# EAGLE board sha2017_rev1_0_1 (EAGLE 6.6.0)
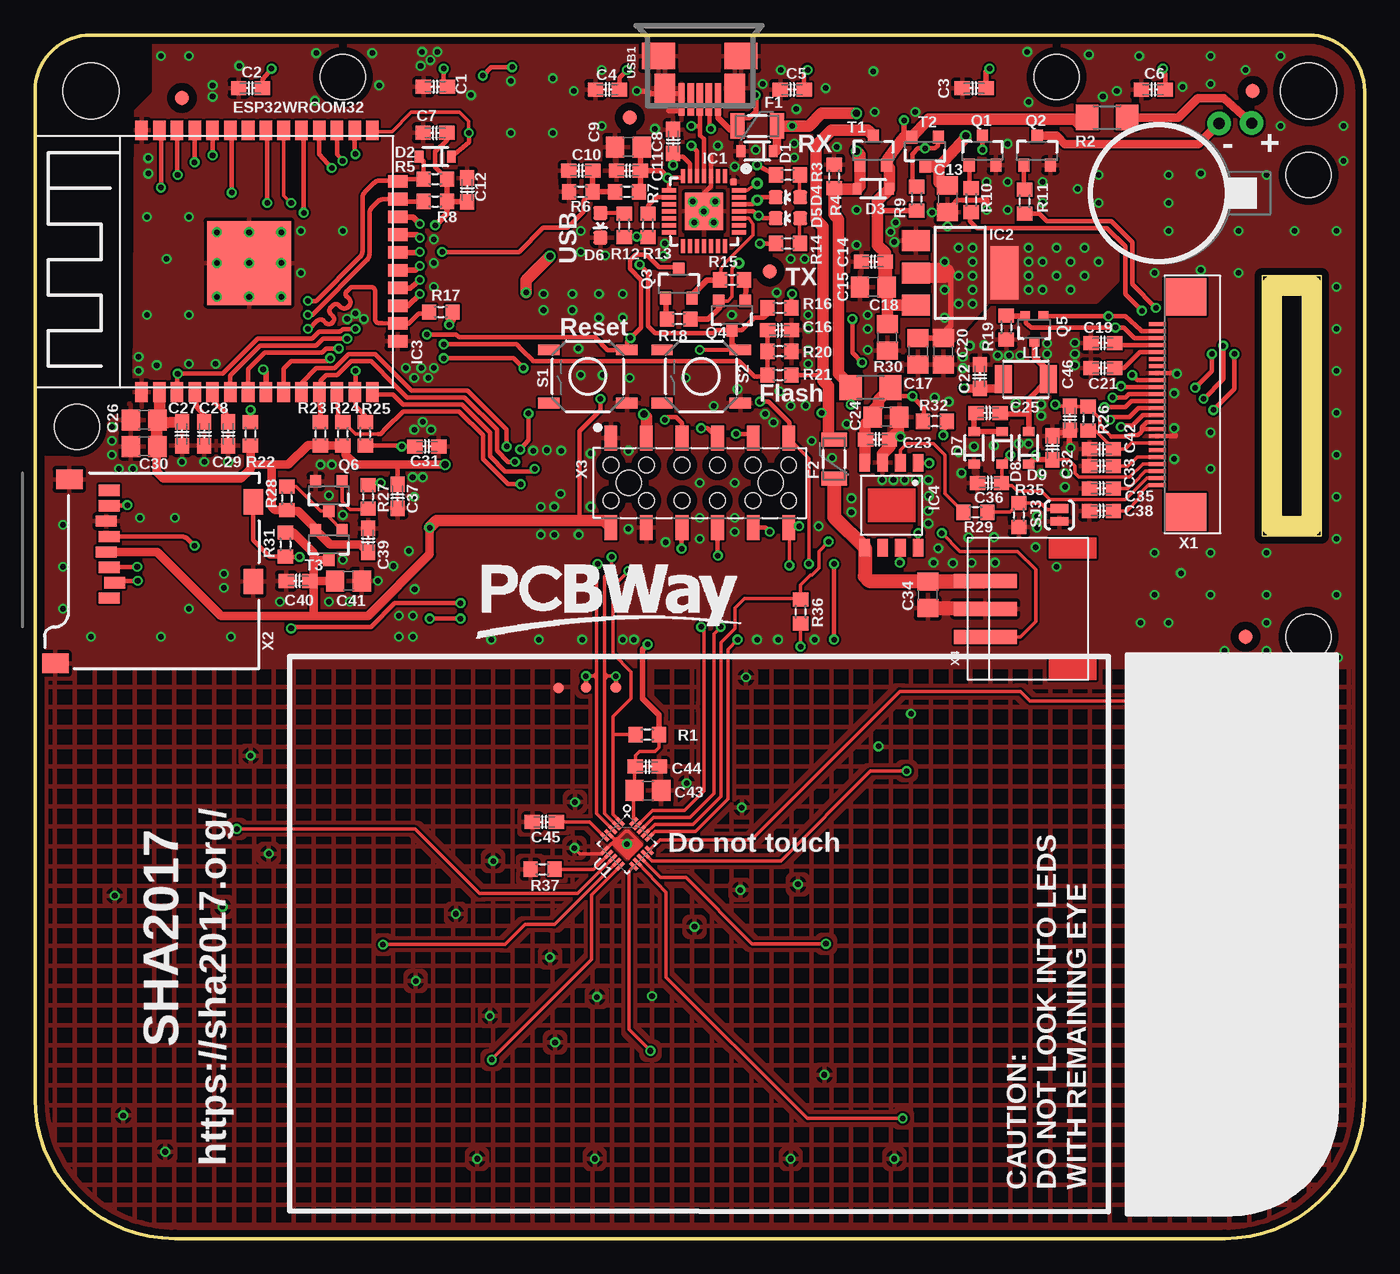
[diagram p3: board, top side]
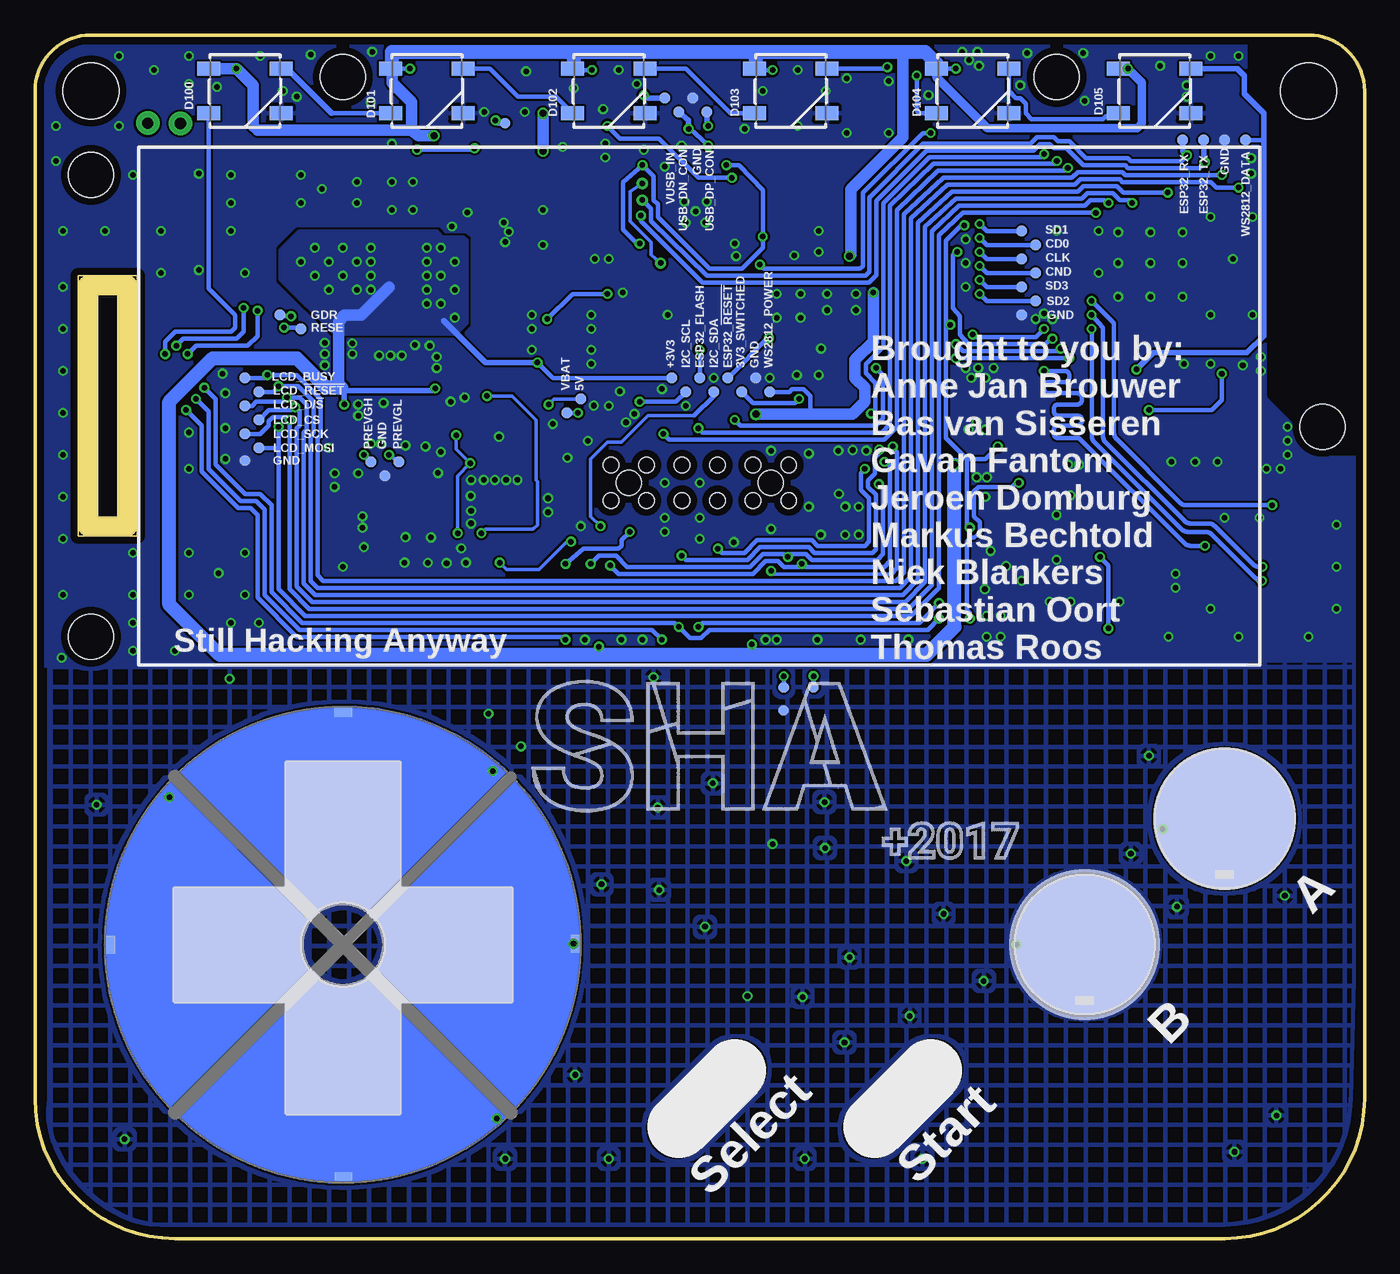
[diagram p4: board, bottom side, seen from below]

Size 95 x 86 mm. Coordinates in mm from the lower left corner, seen from the top.
Outline: 87.7,67.6 87.7,68.8
Outline: 87.7,68.8 91.9,68.8 91.9,50.2 87.7,50.2 87.7,68.8
Outline: 91,86 4,86 arc90 0,82 0,10 arc90 10,0 85,0 arc90 95,10 95,82 arc90 91,86
Copper layers (1*16): Top 0.035mm / dielectric 1.6mm / Bottom 0.035mm
Design rules "Elecrow_2-layer_PCB_eagle_rule": minimum track width 6mil, minimum drill 12mil, track to track 6mil, track to pad 6mil, pad to pad 6mil, via to via 8mil, smd to smd 0mil, copper to edge 20mil, drill to drill 10mil, minimum pad ring 6mil, minimum via ring 6mil, stop-mask expansion 0mil, vias tented up to drill 100mil, thermal gap 10mil
Net classes: 1 FAT: width 0.2 mm, drill 0.4 mm; 2 GND/3V3: width 0.2 mm, drill 0.4 mm; 3 Touch: width 0.2 mm, clearance 1 mm; 4 touch prox: width 0.2 mm, clearance 1.6 mm
Holes 4 mm at 91,82 4,82
Holes 3.2 mm at 3,58 91,43 91,76 22,83 73,83
Holes 1.8 mm at 42.42,54 52.58,54
tRestrict: area -0.3,56.1 to 8.2,86.1
bRestrict: area -0.3,56.1 to 8.2,86.1
Milling: 4 lines

## Footprints (pad centres in the part's own frame; a part is rotated, then mirrored left to right if it is on the bottom)
VIA = drill 0.4 pad 0.705: P$1 0,0
C0603-DASHES = smd 1.1 x 1: 1 -0.85,0; 2 0.85,0
C0805 = smd 1.3 x 1.5: 1 -0.95,0; 2 0.95,0
SOD-323 = smd 0.63 x 0.83: A 1.15,0; C -1.15,0
LED-0603 = smd 1 x 1: A 0,-0.877; C 0,0.877
WS2812B = smd 1.651 x 1: 1 -2.577,1.6; 2 -2.577,-1.6; 3 2.577,-1.6; 4 2.577,1.6
PTC-1206 = smd 1 x 1.8: 1 -1.4,0; 2 1.4,0
FIDUCIAL_1MM = smd 1 x 1: 1 0,0
MLP28 = smd 1 x 0.3: 1 -2.5,1.5; 2 -2.5,1; 3 -2.5,0.5; 4 -2.5,0; 5 -2.5,-0.5; 6 -2.5,-1; 7 -2.5,-1.5; 15 2.5,-1.5; 16 2.5,-1; 17 2.5,-0.5; 18 2.5,0; 19 2.5,0.5; 20 2.5,1; 21 2.5,1.5 | smd 0.3 x 1: 8 -1.5,-2.5; 9 -1,-2.5; 10 -0.5,-2.5; 11 0,-2.5; 12 0.5,-2.5; 13 1,-2.5; 14 1.5,-2.5; 22 1.5,2.5; 23 1,2.5; 24 0.5,2.5; 25 0,2.5; 26 -0.5,2.5; 27 -1,2.5; 28 -1.5,2.5 | smd 2.7 x 2.7: EXP 0,0 | smd 0.435 x 0.435: M -2.103,2.103
SOT223 = smd 1.5 x 2: 1 -2.3,-3.15; 2 0,-3.15; 3 2.3,-3.15 | smd 3.8 x 2: 4 0,3.15
ESP32MOD = smd 6 x 6: 0 9.9,12.3 | smd 1.4 x 0.9: 1 0.68,19.99; 2 0.68,18.72; 3 0.68,17.45; 4 0.68,16.18; 5 0.68,14.91; 6 0.68,13.64; 7 0.68,12.37; 8 0.68,11.1; 9 0.68,9.83; 10 0.68,8.56; 11 0.68,7.29; 12 0.68,6.02; 13 0.68,4.75; 14 0.68,3.48; 25 19.38,3.48; 26 19.38,4.75; 27 19.38,6.02; 28 19.38,7.29; 29 19.38,8.56; 30 19.38,9.83; 31 19.38,11.1; 32 19.38,12.37; 33 19.38,13.64; 34 19.38,14.91; 35 19.38,16.18; 36 19.38,17.45; 37 19.38,18.72; 38 19.38,19.99 | smd 0.9 x 1.4: 15 4.31,1.68; 16 5.58,1.68; 17 6.85,1.68; 18 8.12,1.68; 19 9.39,1.68; 20 10.66,1.68; 21 11.93,1.68; 22 13.2,1.68; 23 14.47,1.68; 24 15.74,1.68
SOP-8 = smd 1.27 x 0.76: 1 -3.035,1.905; 2 -3.035,0.635; 3 -3.035,-0.635; 4 -3.035,-1.905; 5 3.035,-1.905; 6 3.035,-0.635; 7 3.035,0.635; 8 3.035,1.905
1210 = smd 1.2 x 2: 1 -1.6,0; 2 1.6,0
VIBE-MOTOR-10MM = drill 0.8 pad 1.676: + 5,-6.44; - 4.98,-4.11
SOT23-3 = smd 0.8 x 0.9: 1 -0.95,-1; 2 0.95,-1; 3 0,1.1
SOT323 = smd 0.7 x 0.7: 1 -0.65,-0.925; 2 0.65,-0.925; 3 0,0.925
R0603-DASHES = smd 1 x 1.1: 1 -0.85,0; 2 0.85,0
R1206 = smd 1.6 x 1.803: 1 -1.422,0; 2 1.422,0
TACTILE-SWITCH-SMD = smd 1.524 x 0.762: 1 -2.794,1.905; 2 2.794,1.905; 3 -2.794,-1.905; 4 2.794,-1.905
PAD-JUMPER-2-NO_YES_SILK = smd 0.635 x 1.27: 1 -0.45,0; 2 0.45,0
TOUCH_BUTTON = smd 1.27 x 0.635: P$1 0,-4
TOUCH_CROSS = smd 1.27 x 0.635: D 0.03,-16.57; UP 0.02,16.6 | smd 0.635 x 1.27: L -16.59,-0.02; R 16.6,0.06
TOUCH_SELECT = smd 1.27 x 0.635: P$1 0,-1.5
PAD.03X.03 = smd 0.762 x 0.762: P$1 0,0
QFN40P300X300X60-20N = smd 0.711 x 0.254: 1 -1.448,0.787; 2 -1.448,0.406; 3 -1.448,0; 4 -1.448,-0.406; 5 -1.448,-0.787; 11 1.448,-0.787; 12 1.448,-0.406; 13 1.448,0; 14 1.448,0.406; 15 1.448,0.787 | smd 0.254 x 0.711: 6 -0.787,-1.448; 7 -0.406,-1.448; 8 0,-1.448; 9 0.406,-1.448; 10 0.787,-1.448; 16 0.787,1.448; 17 0.406,1.448; 18 0,1.448; 19 -0.406,1.448; 20 -0.787,1.448
MOLEX-47364-0001 = smd 2.3 x 0.45: 1 3.1,1.3; 2 3.1,0.65; 3 3.1,0; 4 3.1,-0.65; 5 3.1,-1.3 | smd 1.9 x 2.375: GND1 0,2.95; GND4 0,-2.95 | smd 2.1 x 1.475: GND2 2.3,2.5; GND3 2.3,-2.5
68712414022 = smd 0.3 x 1.2: 1 -5.75,0.6; 2 -5.25,0.6; 3 -4.75,0.6; 4 -4.25,0.6; 5 -3.75,0.6; 6 -3.25,0.6; 7 -2.75,0.6; 8 -2.25,0.6; 9 -1.75,0.6; 10 -1.25,0.6; 11 -0.75,0.6; 12 -0.25,0.6; 13 0.25,0.6; 14 0.75,0.6; 15 1.25,0.6; 16 1.75,0.6; 17 2.25,0.6; 18 2.75,0.6; 19 3.25,0.6; 20 3.75,0.6; 21 4.25,0.6; 22 4.75,0.6; 23 5.25,0.6; 24 5.75,0.6 | smd 2.7 x 3: 25 -7.68,-1.38; 26 7.68,-1.38
MICRO-SD-SOCKET-PP = smd 0.8 x 1.5: 1 -8.94,10.7; 2 -7.84,10.3; 3 -6.74,10.7; 4 -5.64,10.9; 5 -4.54,10.7; 6 -3.44,10.9; 7 -2.34,10.7; 8 -1.24,10.7 | smd 1.8 x 1.4: CD1 -2.05,0.4; CD2 -7.75,0.4 | smd 1.4 x 1.9: GND1 -13.6,14.55; GND3 -0.45,13.55
610X12243021 = smd 0.9 x 1.8: 1 -6.35,3.2; 2 -3.81,3.2; 3 -1.27,3.2; 4 1.27,3.2; 5 3.81,3.2; 6 6.35,3.2; 7 6.35,-3.2; 8 3.81,-3.2; 9 1.27,-3.2; 10 -1.27,-3.2; 11 -3.81,-3.2; 12 -6.35,-3.2 | hole 1.1: -6.35,1.27; -3.81,1.27; -3.81,-1.27; -6.35,-1.27; -1.27,1.27; -1.27,-1.27; 1.27,1.27; 1.27,-1.27; 3.81,1.27; 3.81,-1.27; 6.35,1.27; 6.35,-1.27
JST-PH3 = smd 1 x 4.5: 1 2,0; 2 0,0; 3 -2,0

## Placement (x,y rotation side)
$$U$1  VIA  [VIA]  54.52,25.32 0 top
$$U$2  VIA  [VIA]  90.6,31 0 top
$$U$3  VIA  [VIA]  27.21,18.41 0 top
$$U$4  VIA  [VIA]  16.7,27.5 0 top
$$U$5  VIA  [VIA]  5.7,24.5 0 top
$$U$6  VIA  [VIA]  13.4,23.7 0 top
$$U$7  VIA  [VIA]  50.4,24.9 0 top
$$U$8  VIA  [VIA]  38.54,27.9 0 top
$$U$9  VIA  [VIA]  50.81,40.1 0 top
C1  100n  [C0603-DASHES]  28.6,82.3 0 top
C2  100n  [C0603-DASHES]  15.4,82.2 0 top
C3  100n  [C0603-DASHES]  67.1,82.2 0 top
C4  100n  [C0603-DASHES]  40.9,82.1 0 top
C5  100n  [C0603-DASHES]  54.1,82.1 0 top
C6  100n  [C0603-DASHES]  79.9,82.1 0 top
C7  100n  [C0603-DASHES]  28.59,79 180 top
C8  100n  [C0603-DASHES]  45.6,78.4 90 top
C9  4u7/16V  [C0805]  42.4,78 180 top
C10  100n  [C0603-DASHES]  39,76.3 180 top
C11  100n  [C0603-DASHES]  42.4,76.3 180 top
C12  100n  [C0603-DASHES]  30.88,74.93 90 top
C13  4u7/16V  [C0805]  65.2,74.3 270 top
C14  100n  [C0603-DASHES]  59.9,69.8 180 top
C15  4u7/16V  [C0805]  59.9,68 180 top
C16  100n  [C0603-DASHES]  53.2,64.9 0 top
C17  4u7/16V  [C0805]  63.1,63.4 270 top
C18  4u7/16V  [C0805]  60.9,64.4 270 top
C19  1u  [C0603-DASHES]  76.3,64 0 top
C20  4u7/16V  [C0805]  64.9,63.4 270 top
C21  1u  [C0603-DASHES]  76.3,62.2 0 top
C22  100n  [C0603-DASHES]  67.5,61.6 90 top
C23  100n  [C0603-DASHES]  60.2,57.1 180 top
C24  4u7/16V  [C0805]  60.8,58.7 0 top
C25  1u  [C0603-DASHES]  68.1,59 0 top
C26  4u7/16V  [C0805]  7.8,58.5 180 top
C27  100n  [C0603-DASHES]  10.5,57.5 270 top
C28  100n  [C0603-DASHES]  12.1,57.5 90 top
C29  100n  [C0603-DASHES]  13.8,57.5 90 top
C30  4u7/16V  [C0805]  7.8,56.6 180 top
C31  100n  [C0603-DASHES]  28,56.6 0 top
C32  1u  [C0603-DASHES]  72.7,56.5 270 top
C33  1u  [C0603-DASHES]  76.2,55.2 0 top
C34  4u7/16V  [C0805]  63.8,46 270 top
C35  1u  [C0603-DASHES]  76.2,53.6 0 top
C36  1u  [C0603-DASHES]  68.2,54 0 top
C37  100n  [C0603-DASHES]  25.91,53.03 270 top
C38  1u  [C0603-DASHES]  76.2,52 0 top
C39  1u  [C0603-DASHES]  23.8,49.9 90 top
C40  100n  [C0603-DASHES]  18.8,47 180 top
C41  4u7/16V  [C0805]  22.4,47 0 top
C42  1u  [C0603-DASHES]  76.2,56.4 180 top
C43  4u7/16V  [C0805]  43.8,32.01 0 top
C44  100n  [C0603-DASHES]  43.75,33.72 0 top
C45  100n  [C0603-DASHES]  36.39,29.76 180 top
C46  1u  [C0603-DASHES]  73.94,58.62 270 top
D1  SD05-7  [SOD-323]  51.6,77.7 180 top
D2  NSVR0320MW2T1G  [SOD-323]  28.6,77.3 180 top
D3  NSVR0320MW2T1G  [SOD-323]  59.9,75 180 top
D4  Yellow  [LED-0603]  53.8,74.4 90 top
D5  RED  [LED-0603]  53.8,72.9 90 top
D6  green  [LED-0603]  40.4,72.4 180 top
D7  NSVR0320MW2T1G  [SOD-323]  67.1,56.5 90 top
D8  NSVR0320MW2T1G  [SOD-323]  69.1,56.5 270 top
D9  NSVR0320MW2T1G  [SOD-323]  71,56.5 90 top
D100  SK6812  [WS2812B]  80,82 0 bottom
D101  SK6812  [WS2812B]  67,82 0 bottom
D102  SK6812  [WS2812B]  54,82 0 bottom
D103  SK6812  [WS2812B]  41,82 0 bottom
D104  SK6812  [WS2812B]  28,82 0 bottom
D105  SK6812  [WS2812B]  15,82 0 bottom
F1  1A  [PTC-1206]  51.6,79.5 0 top
F2  1A  [PTC-1206]  57.1,55.7 90 top
FD1  FIDUCIAL  [FIDUCIAL_1MM]  87,82 0 top
FD2  FIDUCIAL  [FIDUCIAL_1MM]  10.5,81.5 0 top
FD3  FIDUCIAL  [FIDUCIAL_1MM]  42.5,80.1 0 top
FD4  FIDUCIAL  [FIDUCIAL_1MM]  52.5,69.1 0 top
FD5  FIDUCIAL  [FIDUCIAL_1MM]  86.5,43 0 top
IC1  CP210X_USB_UART  [MLP28]  47.8,73.4 270 top
IC2  AP2114H  [SOT223]  66.1,69 270 top
IC3  ESP32WROOM32  [ESP32MOD]  27.6,59.8 90 top
IC4  TP4056  [SOP-8]  61.2,52.4 270 top
L1  47µ  [1210]  70.8,61.4 0 top
M1  MOTOR10MM  [VIBE-MOTOR-10MM]  80.5,74.7 90 top
Q1  MMBT2222A  [SOT23-3]  67.7,77.7 0 top
Q2  MMBT2222A  [SOT23-3]  71.6,77.7 0 top
Q3  MMBT2222A  [SOT23-3]  46,68.2 0 top
Q4  MMBT2222A  [SOT23-3]  49.8,66 180 top
Q5  SI1304 BDL  [SOT323]  71.4,65 180 top
Q6  MMBT2222A  [SOT23-3]  21,53.1 180 top
R1  100k  [R0603-DASHES]  43.75,36 0 top
R2  27R  [R1206]  76.6,80.1 180 top
R3  1k  [R0603-DASHES]  53.8,76 180 top
R4  10k  [R0603-DASHES]  57.1,75.9 270 top
R5  10k  [R0603-DASHES]  28.6,75.7 0 top
R6  100k  [R0603-DASHES]  39,74.8 0 top
R7  220k  [R0603-DASHES]  42.3,74.8 0 top
R8  10k  [R0603-DASHES]  28.6,74.1 0 top
R9  10k  [R0603-DASHES]  63,74.3 270 top
R10  10k  [R0603-DASHES]  66.9,74.2 90 top
R11  10k  [R0603-DASHES]  70.7,74.1 270 top
R12  1k  [R0603-DASHES]  42.1,72.4 270 top
R13  10k  [R0603-DASHES]  43.8,72.4 90 top
R14  1k  [R0603-DASHES]  53.8,71.1 180 top
R15  10k  [R0603-DASHES]  49.8,68.5 0 top
R16  10k  [R0603-DASHES]  53.2,66.5 0 top
R17  10k  [R0603-DASHES]  29,66.2 0 top
R18  10k  [R0603-DASHES]  46,65.7 180 top
R19  2R7  [R0603-DASHES]  69.4,65.1 270 top
R20  100k  [R0603-DASHES]  53.2,63.4 180 top
R21  220k  [R0603-DASHES]  53.2,61.7 0 top
R22  10k  [R0603-DASHES]  15.4,57.5 90 top
R23  4k7  [R0603-DASHES]  20.4,57.5 90 top
R24  4k7  [R0603-DASHES]  22,57.5 90 top
R25  10k  [R0603-DASHES]  23.6,57.5 270 top
R26  0R  [R0603-DASHES]  75.26,58.58 270 top
R27  10k  [R0603-DASHES]  23.8,53 270 top
R28  10k  [R0603-DASHES]  18,52.9 270 top
R29  1.2k  [R0603-DASHES]  67.2,51.9 0 top
R30  0R27 1/4W  [R1206]  59.7,60.8 0 top
R31  100k  [R0603-DASHES]  17.9,49.6 270 top
R32  10k  [R0603-DASHES]  64.3,58.4 180 top
R35  1.2k  [R0603-DASHES]  70.3,51.7 270 top
R36  100k  [R0603-DASHES]  54.7,44.8 270 top
R37  75k 1%  [R0603-DASHES]  36.26,26.39 0 top
S1  SWITCH-MOMENTARY-2SMD  [TACTILE-SWITCH-SMD]  39.5,61.6 180 top
S2  SWITCH-MOMENTARY-2SMD  [TACTILE-SWITCH-SMD]  47.6,61.6 180 top
SJ3  JUMPER-PAD-2-NOYES_SILK  [PAD-JUMPER-2-NO_YES_SILK]  73.2,51.7 90 top
T1  [SOT23-3]  59.9,77.7 0 top
T2  [SOT23-3]  63.6,77.7 180 top
T3  [SOT23-3]  21,49.6 180 top
TOUCH_A  TOUCHROUND  [TOUCH_BUTTON]  10,30 0 bottom
TOUCH_B  TOUCHROUND  [TOUCH_BUTTON]  20,21 0 bottom
TOUCH_SEL  TOUCH_CROSS  [TOUCH_CROSS]  73,21 0 bottom
TOUCH_SELECT  TOUCHSELECT  [TOUCH_SELECT]  47,10 45 bottom
TOUCH_START  TOUCHSELECT  [TOUCH_SELECT]  33,10 45 bottom
TP1  TEST-POINT3  [PAD.03X.03]  37.41,39.36 0 top
TP2  TEST-POINT3  [PAD.03X.03]  39.37,39.39 180 top
TP3  TEST-POINT3  [PAD.03X.03]  41.5,39.38 0 top
TP100  TEST-POINT3  [PAD.03X.03]  41.5,39.38 0 bottom
TP101  TEST-POINT3  [PAD.03X.03]  39.37,39.39 180 bottom
TP102  TEST-POINT3  [PAD.03X.03]  41.52,37.72 0 bottom
TP103  TEST-POINT3  [PAD.03X.03]  70,54.5 0 bottom
TP104  TEST-POINT3  [PAD.03X.03]  71,55.5 0 bottom
TP105  TEST-POINT3  [PAD.03X.03]  69,55.5 0 bottom
TP106  TEST-POINT3  [PAD.03X.03]  80,55.6 0 bottom
TP107  TEST-POINT3  [PAD.03X.03]  79,56.5 0 bottom
TP108  TEST-POINT3  [PAD.03X.03]  80,57.5 0 bottom
TP109  TEST-POINT3  [PAD.03X.03]  79,58.5 0 bottom
TP110  TEST-POINT3  [PAD.03X.03]  57,59 0 bottom
TP111  TEST-POINT3  [PAD.03X.03]  80,59.5 0 bottom
TP112  TEST-POINT3  [PAD.03X.03]  56,60 0 bottom
TP113  TEST-POINT3  [PAD.03X.03]  79,60.5 0 bottom
TP114  TEST-POINT3  [PAD.03X.03]  48.5,60.5 0 bottom
TP115  TEST-POINT3  [PAD.03X.03]  46.5,60.5 0 bottom
TP116  TEST-POINT3  [PAD.03X.03]  44.5,60.5 0 bottom
TP117  TEST-POINT3  [PAD.03X.03]  42.5,60.5 0 bottom
TP118  TEST-POINT3  [PAD.03X.03]  80,61.5 0 bottom
TP119  TEST-POINT3  [PAD.03X.03]  49.5,61.5 0 bottom
TP120  TEST-POINT3  [PAD.03X.03]  47.5,61.5 0 bottom
TP121  TEST-POINT3  [PAD.03X.03]  45.5,61.5 0 bottom
TP122  TEST-POINT3  [PAD.03X.03]  43.5,61.5 0 bottom
TP123  TEST-POINT3  [PAD.03X.03]  76,65 0 bottom
TP124  TEST-POINT3  [PAD.03X.03]  77.5,66 0 bottom
TP125  TEST-POINT3  [PAD.03X.03]  24.5,66 0 bottom
TP126  TEST-POINT3  [PAD.03X.03]  23.5,67 0 bottom
TP127  TEST-POINT3  [PAD.03X.03]  24.5,68 0 bottom
TP128  TEST-POINT3  [PAD.03X.03]  23.5,69 0 bottom
TP129  TEST-POINT3  [PAD.03X.03]  61.4,79.7 0 bottom
TP130  TEST-POINT3  [PAD.03X.03]  24.5,70 0 bottom
TP131  TEST-POINT3  [PAD.03X.03]  23.5,71 0 bottom
TP132  TEST-POINT3  [PAD.03X.03]  24.5,72 0 bottom
TP133  TEST-POINT3  [PAD.03X.03]  13,78.5 0 bottom
TP134  TEST-POINT3  [PAD.03X.03]  11.5,78.5 0 bottom
TP135  TEST-POINT3  [PAD.03X.03]  10,78.5 0 bottom
TP136  TEST-POINT3  [PAD.03X.03]  8.5,78.5 0 bottom
TP137  TEST-POINT3  [PAD.03X.03]  49,80.5 0 bottom
TP138  TEST-POINT3  [PAD.03X.03]  47,80.5 0 bottom
TP139  TEST-POINT3  [PAD.03X.03]  50,81.5 0 bottom
TP140  TEST-POINT3  [PAD.03X.03]  48,81.5 0 bottom
U1  MPR121QR2  [QFN40P300X300X60-20N]  42.3,28.2 315 top
U$2  VIA  [VIA]  50.5,30.8 0 top
U$3  VIA  [VIA]  15.4,34.5 0 top
U$4  VIA  [VIA]  32.5,15.9 0 top
U$5  VIA  [VIA]  46.56,32.53 0 top
U$6  VIA  [VIA]  32.74,26.98 0 top
U$10  VIA  [VIA]  40.15,17.26 0 top
U$11  VIA  [VIA]  30.07,23.2 0 top
U$12  VIA  [VIA]  36.8,20.1 0 top
U$13  VIA  [VIA]  47.13,22.27 0 top
U$14  VIA  [VIA]  37.16,14 0 top
U$15  VIA  [VIA]  56.4,11.7 0 top
U$16  VIA  [VIA]  6.3,8.8 0 top
U$17  VIA  [VIA]  88.6,7.1 0 top
U$18  VIA  [VIA]  9.3,6.2 0 top
U$19  VIA  [VIA]  31.6,5.7 0 top
U$20  VIA  [VIA]  40,5.7 0 top
U$21  VIA  [VIA]  54,5.7 0 top
U$22  VIA  [VIA]  61.4,5.7 0 top
U$23  VIA  [VIA]  38.58,31.18 0 top
USB1  MOLEX-47346-0001  [MOLEX-47364-0001]  47.5,84.5 270 top
X1  [68712414022]  80.8,59.6 90 top
X2  2908-05WB-MG  [MICRO-SD-SOCKET-PP]  16,54.7 90 top
X3  [610X12243021]  47.5,54 0 top
X4  JST-PH3  [JST-PH3]  67.9,45 270 top

## Tracks (layer width: path | path; a pad name or v marks a point on that pad's centre or on a via)
3V3_SWITCHED  (via drill 0.4)
  Top 0.305: v40.4,60 40.4,59.2 38.9,57.7 38.9,51.3 | 41.2,50.8 X3.12 | 29.45,76.05 R5.2 28.6,76.55 28.6,77.65 | 28.6,77.7 28.6,77.65 | 28.7,72.5 v28.6,72.4 | v29.6,65.3 29.9,65.6 29.9,66.15 R17.2 | 26.85,56.65 C31.1 v26.2,56.6 26.15,56.65 R25.2 | C7.1 29.44,78.49 28.6,77.65
  Top 0.406: C12.1 29.45,74.08 R8.2 | 28.7,72.5 29.45,73.25 R8.2 | R8.2 R5.2
  Top 0.61: C40.1 19.75,47 | 19.75,47 19.9,47.25 | C40.1 19.9,46.75 19.9,44.5 | 19.9,44.5 13.3,44.5 8.74,49.06 X2.4 | 19.9,44.5 23.8,44.5 28.2,48.9 v28.2,50.8 | 19.75,47 C41.1 | R31.1 18.45,50.45 19.9,49 19.9,48.7 | 19.9,48.7 19.9,47.25 | 19.9,47.25 C40.1 | T3.3 20.1,48.5 19.9,48.7
  Top 0.813: X3.12 40.65,51.3 38.9,51.3 37.7,51.3 28.7,51.3 v28.2,50.8
  Bottom 0.305: TP116.P$1 43.7,59.7 40.7,59.7 v40.4,60 | v28.6,72.4 28.8,72.4 29.9,71.3 29.9,65.6 | 29.9,65.6 29.9,57.2 28.4,55.7 | 29.9,65.6 v29.6,65.3 | v28.2,50.8 28.4,51 28.4,55.7 | v26.2,56.6 27.1,55.7 28.4,55.7
+3V3  (via drill 0.4, 0.5)
  Top 0.254: U1.20 42.77,31.93 C43.1 42.85,33.66 C44.1 42.9,34.51 43.2,34.8 44.3,34.8 44.6,35.1 R1.2 | R36.2 v54.7,42.3 | 76.9,57.3 76.1,58.1 76.1,58.6 R26.1 | v72.9,59.6 73.03,59.47 C46.1 74.08,59.43 R26.1
  Top 0.305: X1.10 79.45,58.35 79.1,58 | 79.1,58 79.1,57.7 | 79.1,57.7 arc-90 79.25,57.85 X1.9 | R16.2 54.05,67.45 v54.1,67.5 | v58.4,65.7 58.4,63.3 v59.1,62.6 | C37.1 25.9,53.9 25.9,55.3 | 79.1,58 79.1,57.7 | 79.1,57.7 79,57.6 78.8,57.4 78.2,57.4 78.1,57.3 76.9,57.3 | R26.1
  Top 0.406: R1.2 44.59,37.41 43.4,38.6 43.4,42.08 v43.77,42.46 | C17.1 64.55,64.35 65.45,65.25 65.45,68.55 65,69
  Top 0.61: L1.1 69.3,61.3 69.3,60.9 69.15,60.75 C22.1 v66.4,60.75 | 16.9,55.3 16.9,52.3 17.15,52.05 R28.2 17.95,52 18.8,52 20.05,50.75 T3.2 | T3.2 20.05,50.45 | C39.1 23.25,49.6 21.1,49.6 20.1,50.6 T3.2 | 8.7,56.7 8.7,54.8 9.2,54.3 14.7,54.3 15.4,55 15.4,55.3 | 15.4,55.3 R22.1 | 16.9,55.3 15.4,55.3 | v29.3,55.3 25.9,55.3 22.9,55.3 22.2,56 22.2,56.45 R24.1 R23.1 20.35,56.7 19.5,56.7 18.1,55.3 16.9,55.3
  Top 0.813: IC3.2 8.9,60.4 8.9,58.5 | 8.9,58.5 C26.1 | 8.9,58.5 8.78,58.22 8.62,58.28 | 8.62,58.28 C27.1 | C30.1 8.7,56.7 8.7,57.9 9.2,58.4 8.62,58.28
  Top 1.422: 65,69 62.9,69
  Bottom 0.254: v54.7,42.3 54.7,42.1 54.3,41.7
  Bottom 0.305: v54.1,67.5 56.6,67.5 v58.4,65.7 | 49.3,42 49.3,41.7 | v43.77,42.46 43.77,41.67 44.2,41.7 | v59.1,62.6 58,61.5 TP119.P$1
  Bottom 0.406: v72.9,59.6 72.9,60.6 | 72.9,60.6 73.1,60.8 | 72.9,60.6 66.55,60.6 v66.4,60.75 | v59.1,62.6 62.8,62.6 65.8,65.6
  Bottom 0.813: 73.3,60.8 73.3,65.5 72.9,66 71.7,66 69.7,68
  Bottom 1.016: 73.1,60.8 73.3,60.8 74.2,60.8 76.3,62.9 82.3,62.9 85.4,59.8 85.4,45.3 81.8,41.7 54.3,41.7 49.3,41.7 44.2,41.7 31.3,41.7 29.3,43.7 v29.3,55.3
  other vias: 71,70.8 73,70.8 75,70.8 74,69.8 72,69.8 71,68.8 73,68.8 75,68.8 76,69.8 74,67.8 72,67.8 67,67.8 67,69.8 66,68.8 66,70.8 65,69.8 65,67.8 66,66.8 65,65.8 71,67.8 71,69.8 67,68.8 67,70.8 67,66.8
  pour Top (no thermals): 65.5,64.1 68.1,67 75.8,67 77.3,68.5 77.3,70.7 76.5,71.6 63.7,71.6 63.4,71.1 64.2,70.3 64.3,64.8 65,64.1
  pour Bottom: 64.2,71.3 64.2,65.5 65,64.7 73.5,64.7 77.4,68.6 77.4,70.6 76.1,71.9 66.3,71.9 65.9,71.5 64.4,71.5
+5V  (via drill 0.4, 0.4 pad 0.61, 0.5)
  Top 0.305: 45.4,75.8 45.3,75.7 IC1.8 | 45.4,75.8 46.2,75.8 IC1.7 | 45.4,75.8 v45.2,75.8 | v58.3,59.6 58.55,60.65
  Top 0.406: 43.3,77.6 C9.1 43.25,77.9 C11.1 | C11.1 43.25,74.9 R7.2 | C11.1 44.7,76.3 v45.2,75.8
  Top 0.61: D1.C 53,77.9 F1.2 53,77.7 D1.C
  Top 0.813: R4.2 57.1,75 | 57.1,75 D3.A 58.95,75.2 T1.1 58.95,77.45 v58.7,77.7 | v58.7,80.4 56.2,80.4 55.3,79.5 v54.1,79.5 | v54.1,79.5 F1.2 | v54.1,79.5 53.1,79.5 53,79.6 | 57.1,75 57.1,73.2 57.4,72.8 57.4,61.8 58.55,60.65 58.3,60.7 R30.1
  Bottom 0.254: TP112.P$1 57.9,60 v58.3,59.6
  Bottom 0.305: v54.1,79.5 53.2,78.6 50.4,78.6 47.6,75.8 v45.2,75.8
  Bottom 0.813: v58.7,77.7 v58.7,80.4
CD0  (via drill 0.4)
  Top 0.406: IC3.21 27.27,71.73 v27.5,71.5
  Bottom 0.305: v27.5,71.5 27,71 TP131.P$1
CHRG_STAT  (via drill 0.4)
  Top 0.254: v56.7,49.8 56,49.1 56,47.9 55.5,47.4 55.4,47.4 54.7,46.7 R36.1 | v61.8,48.3 61.8,49.33 IC4.7 | 54.72,45.67 R36.1 | R36.1 54.61,45.74 50.7,45.74 50,45.04 50,43.6 49,42.6 49,38.5 49,31.6 47,29.6 44.3,29.6 43.63,28.93 U1.17
  Bottom 0.254: v56.7,49.8 57,49.8 59,47.8 61.3,47.8 v61.8,48.3
CLK  (via drill 0.4)
  Top 0.406: IC3.20 27.46,70.46 v27.5,70.5
  Bottom 0.305: v27.5,70.5 27,70 TP130.P$1
CND  (via drill 0.4)
  Top 0.406: IC3.19 27.19,69.19 v27.5,69.5
  Bottom 0.305: v27.5,69.5 27,69 TP128.P$1
ESP32_!RESET  (via drill 0.4)
  Top 0.305: R22.2 v15.4,59.2 | 10.2,60.53 IC3.3 10.15,61.75 v10.2,61.8 13.4,61.8 15.9,64.3 19.8,64.3 20.3,64.8 21.8,64.8 22,65 v22.9,65 | v28,64.6 30.1,64.6 30.3,64.4 40,64.4 40.9,63.5 S1.3 42.29,64.09 v42.55,64.35 | v42.55,64.35 42.9,64.7 | 42.9,64.7 43.3,65.1 43.3,68.5 42.5,69.3 42.5,69.9 42.9,70.3 43.7,70.3 44.6,69.4 45.9,69.4 Q3.3 | v42.55,64.35 42.9,64.7
  Bottom 0.305: v15.4,59.2 10.9,59.2 10.2,59.9 v10.2,61.8 | v22.9,65 23.5,64.4 27.8,64.4 v28,64.6 | TP121.P$1 42.55,64.45 v42.55,64.35
ESP32_FLASH  (via drill 0.4)
  Top 0.254: 24.1,79 24.2,79.1 25.51,79.1 26.88,80.47 30.35,80.47 30.99,79.83 30.99,78.89 v31,79
  Top 0.305: R16.1 52.4,66.75 52.4,66.1 52.1,65.8 51.4,65.8 50.5,64.9 Q4.3 48.7,64.9 48.5,64.7 44.3,64.7 43.8,65.2 43.8,69 v43.2,69.6 | 24.2,79.1 IC3.25 | v47.5,63.5 S2.3 | D2.C 31,78.35 v31,79
  Top 0.406: Q4.3 49.8,63.9 50.2,63.51 S2.3
  Bottom 0.305: v43.2,69.6 42.9,69.3 36.4,69.3 36.05,69.3 35.85,69.5 35.85,74.72 31.57,79 v31,79 | TP120.P$1 v47.5,63.5
ESP32_RX  (via drill 0.4, 0.4 pad 0.81)
  Top 0.254: IC1.26 51.3,73.9 v51.6,74.2
  Top 0.305: IC1.26 51.3,73.9 v51.6,74.2 51.7,74.4 D4.C | v12.7,77.4 IC3.34
  Bottom 0.305: v51.6,74.2 51,73.6 51,72.7 47,68.8 44.5,68.8 36.2,68.8 35.66,68.8 35.36,69.1 35.36,74.4 35.3,74.46 31.54,78.22 25.46,78.22 23.88,78.22 23.4,78.7 22.2,78.7 21.9,78.4 21.1,78.4 21,78.3 19.9,77.2 16.9,77.2 16.7,77 13.1,77 v12.7,77.4
  Bottom 0.406: TP133.P$1 13,77.7 v12.7,77.4
ESP32_TX  (via drill 0.4, 0.4 pad 0.41)
  Top 0.254: IC1.25 51.3,73.4
  Top 0.305: IC1.25 51.3,73.4 | 51.3,73.4 v51.7,73.1 | v51.7,73.1 52,72.9 D5.C | 51.3,73.4 v51.7,73.1 | v11.4,76.9 11.4,79.16 IC3.35
  Bottom 0.305: v51.7,73.1 51.7,72.7 47.3,68.3 44.7,68.3 36,68.3 35.42,68.3 34.87,68.85 34.87,74.17 31.29,77.75 23.65,77.75 23.6,77.8 23.2,78.2 22.5,78.2 22.2,77.9 21.3,77.9 20.1,76.7 17.1,76.7 16.9,76.5 11.8,76.5 v11.4,76.9
  Bottom 0.406: TP134.P$1 11.5,77 v11.4,76.9
EXTIO-0  (via drill 0.4)
  Top 0.305: X3.3 46.23,58.27 45.8,58.7 45.2,58.7 v45,58.5 | 17.7,60.55 IC3.9 17.77,62.17 18.3,62.7 20.9,62.7 v21.1,62.9 | v29.2,62.9 34.2,62.9 v34.9,62.2
  Bottom 0.305: v45,58.5 44.6,58.1 34.9,58.1 34.4,58.6 34.4,61.7 v34.9,62.2 | v21.1,62.9 v29.2,62.9
EXTIO-1  (via drill 0.4)
  Top 0.305: IC3.27 21.58,77.5 v21.98,77 | v47.6,57.9 48.07,57.9 X3.4
  Bottom 0.305: v21.98,77 22.14,76.8 30.8,76.8 33.9,73.8 33.9,58.2 34.5,57.6 47.3,57.6 v47.6,57.9
EXTIO-2  (via drill 0.4)
  Top 0.305: IC3.28 20.31,77.49 v21.2,76.5 | v50.1,57.5 51.01,57.5 X3.5
  Bottom 0.305: v21.2,76.5 21.4,76.3 30.5,76.3 33.4,73.5 33.4,58 34.3,57.1 49.7,57.1 v50.1,57.5
EXTIO-3  (via drill 0.4)
  Top 0.305: 48.83,50.74 X3.9 48.77,48.83 v48.8,48.8 | IC3.26 22.85,78.01 22.85,77.89 v22.89,77.49 | v35.26,58.95 35.26,57.07 v34.67,56.38
  Bottom 0.305: v22.89,77.49 22.89,77.46 23.08,77.27 24.07,77.27 31.1,77.27 34.38,73.99 34.38,63.72 35.63,62.47 35.63,61.83 34.93,61.13 34.93,59.28 v35.26,58.95 | v34.67,56.38 34.67,56.12 34.9,55.89 34.95,55.84 34.97,55.82 34.97,54.66 35.48,54.15 35.48,53.71 34.92,53.15 34.92,49.25 35.17,49 39.3,49 39.7,49.4 43.1,49.4 43.2,49.4 44.1,48.5 48.5,48.5 v48.8,48.8
EXTIO-4  (via drill 0.4)
  Top 0.305: IC3.14 24.14,60.5 24.34,60.3 25.6,60.3 26.3,59.6 30.5,59.6 32.5,57.6 32.5,56.4 32.5,55.9 33.6,54.8 35.1,54.8 35.5,54.8 v35.7,55 | v46.2,49.3 46.2,50.77 X3.10
  Bottom 0.305: v35.7,55 36,54.7 36,53.5 35.4,52.9 35.4,49.8 35.7,49.5 39.1,49.5 39.5,49.9 39.7,49.9 43.4,49.9 44.3,49 45.9,49 v46.2,49.3
GDR  (via drill 0.4)
  Top 0.305: v76.7,65.9 77.9,65.9 79,64.9 79.05,64.85 X1.23 | v76.7,65.9 76.4,65.9 | 76.4,65.9 72.1,65.9 Q5.1 | v76.7,65.9 76.4,65.9
  Bottom 0.305: TP124.P$1 77.4,65.9 v76.7,65.9
GND  (via drill 0.4, 0.4 pad 0.61)
  Top 0.254: U1.4 41.37,28.56 41.66,28.56 42.2,29.1 42.4,29.1 43.3,28.2 43.3,28.1 42.4,27.2 42.3,27.2 42,27.5 | 38.54,27.61 $$U$8.P$1 38.94,27.5 40.5,27.5 U1.6 41.37,28.38 | 42.1,27.5 42.3,27.5 42.4,27.4 42.4,27.5 42.5,27.6 | 42.5,27.6 43.1,28.2 43,28.2 42.8,28.4 42.8,28.2 42.1,27.5 | 42.1,27.5 42,27.5 | 42,27.5 41.6,27.9 | 41.6,27.9 41.9,27.9 42.1,27.7 42.4,27.7 42.5,27.6 | 42.5,27.6 42.4,27.6 41.8,28.2 42,28.4 41.6,28.4 41.5,28.5 41.5,28.4 41.3,28.2 41.6,27.9 | 41.6,27.9 41.6,28.2 41.7,28.3 41.7,28.1 41.8,28 42.3,28 42.7,28.4 42.4,28.4 42.1,28.1
  Top 0.305: 48.3,77.3 IC1.3 48.3,75.8 | 48.3,75.7 48.3,75.2 47.8,74.7 | 65.9,74.2 68,74.2 | X1.17 81.6,61.85 v81.6,61.8 | X1.8 81.5,57.35 81.5,57.4 81.4,57.4 v81.4,57.9
  Top 0.406: v43,82 43.8,82 44,81.8 46.2,81.8 46.2,80.6 45.3,80.6 | C13.2 65.05,73.25 65.9,74.2 | 68,74.2 v68,73.5 | 74.1,56.5 74.1,56.6 73.9,56.8 73.9,57.6 72.95,57.6 C32.1
  Top 0.813: C24.2 61.7,58.65 61.7,57.7 61.1,57.1 C23.1 61.1,57.05 61.1,56.6 60.56,56.06 IC4.3
  Top 1.016: C34.2 67.85,45.05 X4.2
  other vias: 53,67.6 44.9,70.2 45,71.1 71.9,54.68 70.4,63.1 74.3,63.2 72.32,63.96 49.8,66 50,76.6 51.5,77.8 47,74.1 48.6,74.1 48.5,72.6 47.1,72.6 47.8,73.4 48.8,78.1 44.3,79.3 68.8,63.1 69.6,63.1 66.8,63.8 71,56.8 70.3,56.8 67.1,56.6 68.53,56.67 73.58,54.68 74.3,62.4 42.29,28.19 60.28,35.17 81.1,40 62.6,37.5 57.3,78 10.5,55.5 12.1,55.5 13.8,55.5 70.1,59.7 71.9,58.8 66.3,62.2 66.3,63 58,58.2 9,84.5 11,84.5 12.7,82.4 12.7,81.6 20.1,84.7 20,81.3 24.1,84.7 24.6,82.4 37,82.9 40.5,83.5 38.5,82 37,79 40.5,79.5 60,80.5 78.9,84.5 84,84.5 82,82.3 84,82.5 86.5,83.5 89,84.5 89,79.5 93.5,79.5 93.5,77 58.7,73.5 61.5,72.6 58.7,71 61.4,71.2 68,75.5 69.5,75.5 69.5,73.5 72,75.5 72,74 74.5,75 59.5,63.5 59.5,66 59.5,65 64.3,60.1 65.3,59.8 66,56.2 66.2,54.7 65.59,48.26 64.55,49.32 81.88,47.55 64.2,48.3 68.6,48.3 56,50.9 50,51.5 47.5,51.5 47.5,50 50,50.5 45.06,49.76 42.4,50.7 47.5,54 50,54 55.5,57 55.07,59.52 54,59.5 53.21,60.53 48.5,59.5 50.2,60.7 46.5,61.5 42.5,61.5 39,61.7 38.83,63.6 40.56,61.71 36.34,67.5 42,67.5 36.34,66.34 42,65.8 39,72 39,70.5 54,70 55,70 28.3,57.8 26.5,62.2 27.6,62.2 28.5,62.2 28.5,68 22.3,65.7 23.5,65.7 27.1,53 22,51.7 21,53.1 13.5,47.5 10,51.5 7.5,51.5 7,55 6,55 5.5,56 5.5,57 5.5,58 13.5,46.5 17.5,45.5 21,45.5 22.5,45.5 24.5,47 22,48.5 27.13,46.4 27,44.5 26,44.5 36.14,50.3 37.11,50.29 38.85,50.3 36.14,52.29 37.1,52.3 37.56,53.21 39.7,52.3 35.6,56.3 37.6,56.3 39.7,56.1 27.7,58.35 55.25,66 55.25,65 55.25,63.5 55.25,62.5 67.85,63.85 40.75,70.25 54.25,78.25 54.25,77.25 69.5,78.22 8,73 11,73 9.4,70 8,66 11,66 19,69 19,72 22,72 28.5,69.7 76,76 81,76 76,74 81,74 81,72 80,69 83.3,76.1 88,76 86,72 83.3,69.2 86,69 90,72 93,72 93,68 93,65 93,62 93,59 93,56 93,53 93,50 81.4,55.7 84,55 80,49 84,49 84,46 80,46 81,44 79,44 73,48 66.7,50.1 71.5,49.4 88,46 93,46 88,49 88,44 85,42 88,42 36.57,56.34 4,43 9,43 14,43 11,45 2,45 2,48 2,51 26,43 27,43 44.09,17.32 8.1,77.2 8.1,76.1 7.4,63 7.4,62 8.7,62.4 11,62.5 12.9,62.5 31.15,81.7 32.6,42.8 36,42.8 39.1,42.8 42,42.8 51.6,42.8 55.7,42.8 93.1,41.5 84,57.6 81.4,60.4 66.93,48.29 63.87,53.06 58.34,52.9 28.75,84.8 28.25,84.2 27.55,83.8 27.65,84.8 34,82.7 34,79 62.9,80.5 59.9,83.4 56.5,82.2 53.3,83.5 52,82.5 54.4,80.7 14.6,83.8 77.3,82 76.3,81.6 75.3,84.6 70.9,84.8 71,81.2 13,71.9 17.6,71.9 17.6,67.3 13,67.3 15.3,71.9 13,69.7 17.6,69.7 15.3,67.3 15.3,69.7 68.53,50.12 56.95,55.79 65.2,72.32 38.4,67.5 38.4,66.34 40.3,65.8 40.3,67.5 26.98,54.4 27.7,54.4 21.2,55.3 20.4,55.3 28.5,71.4 22.9,66.1 26.71,49.13 25.6,48.06 60.54,54.2 61.84,57.3 61.34,54.2 62.14,54.2 62.94,54.2 63.84,54.2 63.84,52 63.84,51.1 58.34,51.9 53.1,42.8 42.8,42.8 72.32,63.2 74.3,64 71.9,59.6 61.14,71.94 64.1,73.32 27.1,57.8 27.1,61.5 28.1,61.5 52.17,58.92 52.77,58.32 42.4,56.3 74,56.5 73.6,53.7 71.6,51.6 71.6,50.8
  pour Bottom (hatched): 94,41 0.2,41.3 1,10 arc90 10,1 86,1 arc97 94,10
  pour Bottom (rank 6): 95.2,82 95.3,40.9 -0.3,41.3 0.6,83.1 arc-90 3.6,86.1 90.7,86.2 arc-90
  pour Top (rank 3, hatched): -0.9,41.3 95.8,41.1 95.8,-1 -0.9,-1
  pour Top (rank 6): -0.6,86.4 96.1,86.4 96.1,40.9 -1.1,40.9 -1.1,86.5
  pour Top: 42.3,29.2 43.3,28.2 42.4,27.3 42.3,27.3 41.3,28.3 41.4,28.3
I2C_INT  (via drill 0.4)
  Top 0.254: U1.1 41.82,29.78 41.3,30.3 41.3,35.9 | 41.3,35.9 41.3,37.3 42.6,38.6 42.6,40.5 41.3,41.8 41.3,46.6 v42.4,47.7 | R1.1 41.4,36 41.3,35.9
  Top 0.305: IC3.10 19.04,61.14 20.1,62.2 21.4,62.2 22.4,63.2 24.3,63.2 26,61.5 26.9,60.6 30.9,60.6 33.7,57.8 v33.7,56.6
  Bottom 0.254: v42.4,47.7 42.2,47.5 33.8,47.5
  Bottom 0.305: v33.7,56.6 33.7,56.5 33.4,56.2 33.4,47.9 33.8,47.5
I2C_SCL  (via drill 0.4)
  Top 0.254: v55.3,48.2 55.3,55.75 X3.6 | 22.35,58.05 22.9,57.5 24.5,57.5 | U1.2 40.7,30.37 40.7,39.96 | 40.7,39.96 40.7,45.51 40.71,45.52 | v41.2,48.7 v41.19,48.69 41.19,47.8 40.71,47.32 40.71,45.52 | v41.5,40.18 40.71,40.18 40.71,40.4 | 40.71,40.4 40.71,45.52 | 40.71,40.4 40.93,40.18 40.7,39.96
  Top 0.305: IC3.12 21.68,58.27 R24.2 22.35,58.7 22.35,58.05 | v51.8,59.8 52.4,59.8 53.9,58.3 53.9,57.25 X3.6 | TP100.P$1 v41.5,40.18 | 24.5,57.5 24.7,57.5 25.1,57.9 26.3,59.1 30.3,59.1 32,57.4 32,56.2 32,55.7 33.8,53.9 v34.7,53.9
  Bottom 0.305: v34.7,53.9 34.4,53.6 34.4,48.9 34.8,48.5 39.5,48.5 39.9,48.9 41,48.9 v41.2,48.7 41.3,48.7 41.5,48.9 43,48.9 43.9,48 52.7,48 53.5,48.8 54.7,48.8 v55.3,48.2 | TP114.P$1 49.2,59.8 v51.8,59.8 | v41.5,40.18 TP100.P$1
I2C_SDA  (via drill 0.4)
  Top 0.254: v53.9,48.1 53.9,50.75 X3.7 | U1.3 40.13,30.37 40.13,39.99 | 40.13,39.99 40.13,40.18 | 40.13,40.18 40.13,40.4 | 40.13,40.4 40.13,46.33 40.13,48.13 v40.2,48.2 | v39.37,40.19 39.91,40.19 39.92,40.19 | 39.92,40.19 40.12,40.19 40.13,40.18 | 39.92,40.19 40.13,40.4 | 39.92,40.19 39.93,40.19 40.13,39.99 | 53.85,50.85 54.55,50.85 v54.6,50.9
  Top 0.305: IC3.11 R23.2 | R23.2 | R23.2 20.41,60.89 | 20.41,60.89 20.4,60.9 | 20.41,60.89 20.41,61.31 20.8,61.7 21.6,61.7 22.6,62.7 24,62.7 25.7,61 26.6,60.1 30.7,60.1 33,57.8 33,56.6 33,56.3 33.8,55.5 v34.3,55.5 | 53.85,50.85 X3.7 | v39.37,40.19 TP101.P$1
  Bottom 0.254: v40.2,48.2 40.4,48 | v54.6,50.9 55.3,51.6 55.3,55.7 54.1,56.9 53.1,56.9 51.2,58.8 47.9,58.8
  Bottom 0.305: v34.3,55.5 34.2,55.5 33.9,55.2 33.9,48.4 34.3,48 39.9,48 40.1,48.2 v40.2,48.2 | 53.8,48 v53.9,48.1 53.3,47.5 53,47.5 44.9,47.5 43.7,47.5 42.8,48.4 41.9,48.4 41.5,48 40.4,48 | TP115.P$1 46.5,60.2 47.9,58.8 | TP101.P$1 v39.37,40.19
LCD_!RESET  (via drill 0.4)
  Top 0.305: X1.15 77.6,60.85 v77.6,60.9 | 8.98,75.12 v9,75.1 9,79.06 IC3.37
  Top 0.406: 8.88,75.22 v9,75.1
  Bottom 0.305: v9,75.1 10.6,75.1 11,75.5 17.3,75.5 17.5,75.7 20.3,75.7 20.7,75.3 29.8,75.3 32.4,72.9 32.4,47.3 33.2,46.5 74.8,46.5 75.3,47 75.3,57.4 75.1,57.6 75.1,59.8 76.2,60.9 v77.6,60.9 78,60.5 TP113.P$1
LCD_BUSY  (via drill 0.4)
  Top 0.305: 78.7,61.4 v78.4,61.7 78.75,61.35 X1.16 | 10.25,75.95 v10.2,76 | IC3.36 10.15,76.05
  Top 0.406: 10.15,76.05 v10.2,76
  Bottom 0.305: v10.2,76 17.1,76 17.3,76.2 20.5,76.2 20.9,75.8 30.1,75.8 32.9,73.2 32.9,47.6 33.5,47 74.4,47 74.8,47.4 74.8,57.2 74.6,57.4 74.6,60 76.3,61.7 v78.4,61.7 78.6,61.5 TP118.P$1
LCD_CS  (via drill 0.4)
  Top 0.305: v76.4,59.4 77.9,59.4 78.35,59.85 X1.13 | IC3.31 16.6,79.08 v16.6,74
  Bottom 0.305: 76.4,59.5 v76.4,59.4 | v76.4,59.4 76.1,59.1 76.1,58.1 76.3,57.9 76.3,46.6 75.2,45.5 32.8,45.5 31.4,46.9 31.4,72.3 29.2,74.3 20.2,74.3 19.8,74.7 18,74.7 17.5,74.2 16.8,74.2 v16.6,74 | TP109.P$1 78.3,59.2 76.7,59.2 v76.4,59.4
LCD_D/!S  (via drill 0.4)
  Top 0.305: v77,60.1 77.9,60.1 78.15,60.35 X1.14 | IC3.33 14.06,79.08 v14.06,74.74
  Bottom 0.305: v14.06,74.74 17.24,74.74 17.7,75.2 20.1,75.2 20.5,74.8 29.5,74.8 31.9,72.6 31.9,47.1 33,46 75,46 75.8,46.8 75.8,57.6 75.6,57.8 75.6,59.6 76.1,60.1 v77,60.1 77.3,59.8 79.2,59.8 79.5,59.5 TP111.P$1
LCD_MOSI  (via drill 0.4)
  Top 0.305: v77.6,58 77.8,58.1 78.4,58.1 79.15,58.85 X1.11 | 19.14,73.56 v19.2,73.3 19.2,79.02 IC3.29
  Bottom 0.305: v77.6,58 77.6,56.5 | 77.6,56.5 77.6,46.4 75.7,44.5 32.4,44.5 30.4,46.5 30.4,71.7 28.7,73.3 v19.2,73.3 | TP107.P$1 77.6,56.5
LCD_SCK  (via drill 0.4)
  Top 0.254: IC3.30 17.77,74.53 v18.3,74
  Top 0.305: v76.8,58.5 77,58.7 78.2,58.7 78.85,59.35 X1.12
  Bottom 0.305: v18.3,74 18.5,74.1 18.6,74.2 19.6,74.2 20,73.8 29,73.8 30.9,72 30.9,46.7 32.6,45 75.4,45 76.8,46.4 v76.8,58.5 77,58.7 78,58.7 78.3,58.4 78.3,58.1 78.9,57.5 TP108.P$1
LCD_VDD
  Top 0.254: X1.7 78.35,56.85 77.9,56.4 C42.1 76.7,56.75 76.7,56.8 75.77,57.73 R26.2
N$1  (via drill 0.4)
  Top 0.254: U1.9 37.11,22.43 35.02,22.43 33.59,21 v24.86,21
  Bottom 0.254: v24.86,21 21.14,17 TOUCH_B.P$1
N$2
  Bottom 0.305: D101.2 73.8,80.4
  Bottom 0.406: D100.4 77,83.6 73.8,80.4
N$3  (via drill 0.4)
  Top 0.305: v32,83.1 32.6,83.7 v34.1,83.7
  Bottom 0.305: D104.2 31.8,80.4 32,80.6 v32,83.1 | v34.1,83.7 34.1,83.6 D103.4
N$4
  Bottom 0.305: D105.2 17.78,80.2 18.5,80.2 18.7,80 19.2,80 23.8,80 24.2,80.4 24.2,81.1 24.6,81.5 24.9,81.5 25.42,82.02 D104.4
N$6  (via drill 0.4)
  Top 0.254: v14.42,29.26 27.18,29.26 31.78,24.65 38.76,24.65 U1.8
  Bottom 0.254: 14.51,29.29 14.57,29.23 14.67,29.23 v14.42,29.26 13.26,29.26 TOUCH_A.P$1
N$7
  Top 0.254: IC4.2 61.84,56.34 62.3,56.8 64.2,56.8 65,56 65,53.25 R29.1
N$8
  Top 0.305: IC1.9 44.4,74.4 43.8,73.8 R13.2
N$9
  Top 0.254: R29.2 69.65,51.9 R35.1 71.85,52.55 72.3,52.1 73.15,52.1 SJ3.2
N$10
  Top 0.254: IC1.24 51,72.9 51.3,72.5 51.3,71.7 49.4,69.8 49,69.3 R15.1
  Top 0.406: R15.1 48,68.5 47,67.5 Q3.2
N$11  (via drill 0.4 pad 0.81)
  Top 0.254: Q4.2 49.5,67 49.8,67.3 49.8,69.3 50.2,69.7 v50.3,69.7 | IC1.28 50.9,74.9 v51.6,75.4
  Top 0.406: R18.1 48.1,65.7 48.9,66.5 Q4.2
  Bottom 0.254: v51.6,75.4 52.5,74.8 52.5,72.7 51,71.2 51,70.3 v50.3,69.7
N$12  (via drill 0.4)
  Top 0.254: IC4.8 v63.1,50.41 | v62.7,60.2 60.65,60.2 R30.2
  Top 0.305: 60.5,60.2 v62.7,60.2 63.5,59.3 63.5,58.45 R32.2
  Top 0.813: C23.2 59.3,57 | 59.3,57 IC4.4 | 59.3,57 59.3,58.15 C24.1 59.8,58.75 59.8,59.1 60.25,59.55 60.25,59.93 R30.2
  Bottom 0.254: v62.7,60.2 60.9,60.2 59.2,58.5 59.2,54.2 59.1,54.1 59.1,51 59.4,50.7 62.8,50.7 v63.09,50.41 v63.1,50.41
N$13
  Top 0.406: Q4.1 50.8,68.2 R15.2
N$14
  Top 0.406: Q3.1 45.1,66.3 R18.2
N$15
  Top 0.254: Q6.1 21.95,52.65 22.5,52.1 23.75,52.1 R27.2
  Top 0.305: 23.7,52.05 R27.2
N$16
  Top 0.61: M1.- 83.13,78.2 73.6,78.2 73,78.8 Q2.3
N$17
  Top 0.254: T3.1 21,51.55 Q6.3 20.4,52 18.65,53.75 R28.1
N$18
  Top 0.61: R2.1 81.7,80.1 83.1,81.5 84.94,81.5 M1.+
N$19
  Bottom 0.305: D102.2 57.78,81.6 60.5,81.6 62.5,83.6 D101.4
N$20
  Top 0.254: C45.1 39.63,29.76 U1.5
N$21
  Top 0.254: R37.2 39.92,26.39 U1.7
N$22
  Top 0.406: D8.C D7.A 67.1,57.7 67.1,58.5 arc-90 C25.1
N$23
  Top 0.406: C25.2 69.2,58.9 71,58.9 | Q5.3 71.4,63 72.3,62.1 72.3,61.5 L1.2 71,60 71,58.9 | 71,58.9 D9.A
N$24  (via drill 0.4)
  Top 0.254: U1.10 39.78,24.56 39.78,19.95 32.64,12.81 v32.64,12.78
  Bottom 0.254: v32.64,12.78 31.94,12.08 TOUCH_START.P$1
N$25  (via drill 0.4)
  Top 0.254: U1.11 42.45,26.24 42.45,14.94 v43.97,13.41
  Bottom 0.254: v43.97,13.41 43.97,10.9 TOUCH_SELECT.P$1
N$26
  Top 0.254: 42.2,73.3 R12.1
  Top 0.305: D6.A 42.2,73.3
N$27
  Top 0.254: D4.A 54.6,76.1 R3.1
N$28
  Top 0.254: D5.A 54.6,71.1 R14.1
N$32  (via drill 0.4)
  Top 0.406: USB1.1 48.8,80.1 49.7,79.2 F1.1 50.4,79.7 50.4,80.1 51,80.1 51.5,80.5 v51.5,81.7
  Bottom 0.406: TP139.P$1 51.2,81.5 v51.5,81.7
N$42
  Top 0.406: IC3.4 11.5,59.5 12.3,58.6 12.3,58 arc-90 C28.2
N$43
  Top 0.305: C29.2 13.7,58.45 13.7,58.9 12.69,59.91 IC3.5
N$44  (via drill 0.4)
  Top 0.254: U1.12 45.08,24.75 45.08,18.65 54.69,9.1 55.21,8.58 v62,8.58
  Bottom 0.254: v62,8.58 72.8,4.26 TOUCH_SEL.D
N$45
  Top 0.305: R11.1 70.65,75 Q2.1
N$46  (via drill 0.4)
  Top 0.254: v85.4,31.54 85.4,34.8 81.8,38.4 71.1,38.4 70.4,39.1 61.8,39.1 51.2,28.5 44.65,28.5 U1.15
  Bottom 0.254: TOUCH_SEL.L 85.4,25.17 v85.4,31.54
N$47  (via drill 0.4)
  Top 0.254: U1.14 44.08,27 53.3,27 59.7,33.4 v62.28,33.4
  Bottom 0.254: v62.28,33.4 62.2,33 71.8,33 72.98,34.18 TOUCH_SEL.UP
N$48  (via drill 0.4)  (1 unrouted)
  Top 0.254: U1.13 44.7,25.8 46.5,25.8 51.24,21.06 TOUCH_SEL.R | TOUCH_SEL.R v56.52,21.06 TOUCH_SEL.R
  Bottom 0.254: v56.52,21.06 56.5,21.16 56.5,21.7 | 56.5,21.7 56.4,21.6 v56.52,21.06 | v56.52,21.06 56.7,21.36 56.7,22.4 56.5,22.2 56.5,21.7
N$49
  Top 1.016: F2.1 57.1,51.56 IC4.5 59.3,47.3 59.6,47 X4.3 67.85,46.95 C34.1
N$50
  Bottom 0.305: D103.2 45.3,80.4 48.5,83.6 D102.4
N$52
  Top 0.305: R10.2 66.75,75 Q1.1
N$53  (via drill 0.4)
  Top 0.305: 62.85,75.1 R9.1 62.7,75.35 62.7,77.5 63.1,77.9 v63.6,77.9 64.3,77.9 64.5,78.1 64.5,78.75 T2.1 | v67.7,77.8 Q1.3
  Bottom 0.305: v67.7,77.8 63.7,77.8 v63.6,77.9
PREVGH  (via drill 0.4)
  Top 0.254: C32.2 73.85,55.65 74.3,55.2 74.3,54.7 74.6,54.4 78.2,54.4 79.15,55.35 X1.4
  Top 0.305: v71.5,56 D9.C
  Top 0.406: D9.C 71.3,55.65 C32.2
  Bottom 0.305: TP104.P$1 v71.5,56
PREVGL  (via drill 0.4)
  Top 0.254: D8.A 69.1,54.1 C36.2 69.25,53.8 69.8,53.8 70.2,53.4 71.9,53.4 72.5,52.8 74.2,52.8 77.8,52.8 77.9,52.8 79.45,54.35 X1.2
  Top 0.305: v69.7,56 D8.A
  Bottom 0.305: TP105.P$1 v69.7,56
RESE  (via drill 0.4)
  Top 0.305: Q5.2 70.8,66 70.8,65.4 71.2,65.1 v77.2,65.1 77.8,65.1 78.55,64.35 X1.22
  Top 0.406: R19.1 69.5,66.1 69.5,65.9 70.4,65.9 Q5.2
  Bottom 0.305: TP123.P$1 76.1,65.1 v77.2,65.1
SD1  (via drill 0.4)
  Top 0.406: IC3.22 27,73 v27.5,72.5
  Bottom 0.305: TP132.P$1 27,72 v27.5,72.5
SD2  (via drill 0.4)
  Top 0.406: IC3.17 26.65,66.65 v27.5,67.5
  Bottom 0.305: v27.5,67.5 27,67 TP126.P$1
SD3  (via drill 0.4)
  Top 0.406: IC3.18 26.82,67.92 v27.5,68.5
  Bottom 0.305: v27.5,68.5 27,68 TP127.P$1
SD_CD  (via drill 0.4)
  Top 0.254: U1.19 44.13,30.6 46.4,30.6 47.8,32 47.8,38 47.8,43.5 v47.6,43.7
  Top 0.305: X2.CD1 15.6,49.9 16.75,48.75 R31.2 17.95,48.7 v18.9,48.7 | v30.4,45.4 25.7,45.4 24,43.7 18.4,43.7 v18.3,43.6
  Bottom 0.305: v47.6,43.7 47.3,44 31.8,44 v30.4,45.4 | v18.3,43.6 18.3,48.1 v18.9,48.7
SD_CLK  (via drill 0.4)
  Top 0.305: X2.5 10.48,50.16 arc-45 10.93,49.97 v11.4,49.5 | v22.9,62 22.9,60.53 IC3.13 22.9,60.43 22.9,59.5 23.6,58.8 R25.1
  Bottom 0.305: v11.4,49.5 12.44,49.5 arc45 12.89,49.69 20.31,57.11 arc-45 20.53,57.2 | 20.53,57.2 21.2,57.2 | 20.53,57.2 21.4,57.2 21.88,57.2 arc90 22.2,57.52 22.2,57.53 22.2,57.78 arc90 21.88,58.1 20.52,58.1 arc-90 20.2,58.42 20.2,58.48 arc-90 20.52,58.8 21.88,58.8 arc90 22.2,59.12 22.2,59.28 arc90 21.88,59.6 20.52,59.6 arc-90 20.2,59.92 20.2,60.08 arc-90 20.52,60.4 22.57,60.4 22.58,60.4 arc90 22.9,60.72 22.9,60.88 arc90 22.58,61.2 21.42,61.2 arc-90 21.1,61.52 21.1,61.68 arc-90 21.42,62 v22.9,62
SD_CMD  (via drill 0.4)
  Top 0.305: v7.3,48 5.4,48 arc45 X2.3 | v19.5,66 19.8,66 23.71,69.91 arc45 23.9,70.36 23.9,73.24 arc-45 24.09,73.69 24.48,74.08 arc-45 24.93,74.27 IC3.23 26.09,74.1 R8.1
  Bottom 0.305: v7.3,48 7.54,48 arc45 7.99,48.19 10.71,50.91 arc-45 11.16,51.1 12.44,51.1 arc45 12.89,51.29 18.51,56.91 arc45 18.7,57.36 18.7,64.6 18.7,65.1 v19.5,66
SD_DATA0  (via drill 0.4)
  Top 0.305: v19.5,67 20.1,67 23.21,70.11 arc45 23.4,70.56 23.4,74.34 arc-45 23.59,74.79 24.21,75.41 arc-45 24.66,75.6 25.86,75.6 IC3.24 26.08,75.7 R5.1 27.75,77 D2.A | v6.6,52.4 arc-45 6.5,52.36 X2.7
  Bottom 0.305: v19.5,67 17.9,65.4 17.9,57.56 arc-45 17.71,57.11 13.19,52.59 arc-45 12.74,52.4 v6.6,52.4
SD_DATA3  (via drill 0.4)
  Top 0.305: v7.34,47 6.04,47 arc-90 5.9,46.86 X2.2 | v19.5,65 19.6,65 20.18,65.58 arc-90 20.62,65.58 20.77,65.42 arc90 21.23,65.42 21.27,65.47 arc90 21.27,65.92 21.12,66.08 arc-90 21.12,66.53 21.27,66.67 arc-90 21.73,66.67 21.88,66.53 arc90 22.43,66.62 22.38,66.58 arc90 22.48,67.12 22.3,67.3 arc-115 22.31,67.71 22.51,67.91 arc-45 22.73,68 23.98,68 arc-90 24.3,67.68 24.3,65.72 arc90 24.62,65.4 24.8,65.4 IC3.16 26.68,65.38 27.4,66.1 28.05,66.1 R17.1
  Bottom 0.305: v19.5,65 19.5,57.36 arc-45 19.31,56.91 13.09,50.69 arc-45 12.64,50.5 11.36,50.5 arc45 10.91,50.31 7.79,47.19 arc-45 v7.34,47
TEMP  (via drill 0.4)
  Top 0.254: X4.1 70.4,43 71.5,44.1 71.5,47.8 70.2,49.1 66.1,49.1 v64.8,50.4 | v63.9,55.4 63.14,55.4 IC4.1 | R32.1 64.95,57.55 v64.9,57.4
  Bottom 0.254: v64.8,50.4 64.8,54.5 v63.9,55.4 64.9,56.4 v64.9,57.4
USB_DN_CON  (via drill 0.4)
  Top 0.305: IC1.5 47.3,77.7 v46.9,78.1 | v48.3,79.3 48.2,79.6 USB1.2
  Bottom 0.305: v46.9,78.1 47,78.2 48.2,79.3 v48.3,79.3
  Bottom 0.406: TP137.P$1 48.3,79.9 v48.3,79.3
USB_DP_CON  (via drill 0.4)
  Top 0.305: USB1.3 47.5,79.5 | 47.5,79.5 47.5,78.8 47.8,78.6 IC1.4 | v46.9,79.5 47.3,79.5 47.5,79.5
  Bottom 0.406: TP138.P$1 47,79.6 v46.9,79.5
VBAT  (via drill 0.4)
  Top 0.305: R21.2 56.2,61.7 56.3,61.6 | v56.2,59 56.4,59 56.7,59.4
  Top 0.813: F2.2 57.04,57.1 arc-45 56.7,57.1 56.7,59.4 56.7,60.9 56.3,61.3 56.3,61.6 56.3,72.3 55.8,72.8 55.8,78.1 56.9,79.2 59.5,79.2 T1.3
  Bottom 0.305: TP110.P$1 v56.2,59
VBAT_SENSE  (via drill 0.4)
  Top 0.305: C16.1 R20.2 R21.1 52.25,61.6 51.4,61.6 50.3,62.7 35.6,62.7 35.5,62.8 34.8,63.5 34.4,63.9 v29.2,63.9 | IC3.7 15.23,62.13 16,62.9 16.4,63.3 20.1,63.3 20.5,63.3 20.8,63.6 v21.7,63.6
  Bottom 0.305: v21.7,63.6 21.9,63.4 28.7,63.4 v29.2,63.9
VCC  (via drill 0.4)
  Top 0.406: v62.1,79.9 62.1,78.7 | R9.2 60.25,73.45 60.2,73.4
  Top 0.813: R2.2 74.7,79.6 74.3,80 63.85,80 T2.2 62.1,78.7 61.9,78.5 60.95,77.15 T1.2 61.05,76.5 D3.C 60.2,74.15 60.2,73.4 60.2,71 60.75,70.45 C14.1 | C18.1 60.9,66.7 | 60.9,66.7 60.9,67.95 C15.1 | IC2.3 60.9,66.7
  Top 1.016: C15.1 60.8,67.55 C14.1
  Bottom 0.406: TP129.P$1 61.9,79.7 v62.1,79.9
VCOM
  Top 0.254: 77.5,52 C38.2 78,52 78.9,52.9 78.9,53.2 79.55,53.85 X1.1
VDD  (via drill 0.4, 0.4 pad 0.61)
  Top 0.305: R12.2 42.2,71.6 v43,71.6 R13.1 | R14.2 v51.8,71.1 | v51.6,76.7 R3.2 | C8.1 45.7,77.3 | IC1.6 46.8,76.8 46.3,77.3 45.7,77.3 | 45.7,77.3 45.6,77.3 v45.6,76.7
  Bottom 0.305: v51.8,71.1 52,71.1 53,72.1 53,75.5 v51.6,76.7 50.8,75.9 50.8,74.2 50.5,73.9 50.5,73 46.8,69.3 44.5,69.3 43,70.8 v43,71.6 43,74.9 44.7,76.7 v45.6,76.7
VGH
  Top 0.305: X1.20 78.95,63.35 77.8,62.2 C21.2
VGL
  Top 0.254: 76.9,63.9 C19.2
  Top 0.305: X1.21 77.2,63.85 C19.2
VIBRATOR  (via drill 0.4)
  Top 0.254: U1.16 44.32,29.1 47.2,29.1 49.5,31.4 49.5,38.8 49.5,42.1 v50.2,42.8
  Top 0.305: R11.2 71.75,73.25 72.3,72.7 76.9,72.7 78.4,71.2 78.4,68.2 v80.1,66.5 | v84.9,63.8 84.9,61.4 v83.5,60
  Bottom 0.305: v80.1,66.5 80.1,64.8 80.6,64.3 84.4,64.3 v84.9,63.8 | v50.2,42.8 50.9,43.5 76.1,43.5 78.6,46 78.6,52.1 79.2,52.7 80.3,52.7 82.6,55 82.6,59.1 v83.5,60
VSH
  Top 0.254: X1.5 78.75,55.85 78.1,55.2 C33.2
VSL
  Top 0.254: 77.5,53.6 C35.2 78.1,53.6 78.5,54 79.35,54.85 X1.3
VUSB_SENSE  (via drill 0.4)
  Top 0.305: IC3.6 13.96,61.66 16.1,63.8 20.1,63.8 20.6,64.3 v22.3,64.3 | 39.7,74.65 R6.2 39.21,74.16 39.21,73.36 38.07,72.22 36.29,72.22 34.58,70.5 v29.1,70.5
  Top 0.406: R7.1 R6.2 C10.1
  Bottom 0.305: v22.3,64.3 22.4,64.3 22.8,63.9 28.3,63.9 28.9,64.6 28.9,65.9 29.4,66.5 29.4,70.2 arc90 v29.1,70.5
WS2812_DATA  (via drill 0.4)
  Top 0.406: v16.3,62.1 16.5,61.9 IC3.8
  Bottom 0.305: TP136.P$1 8,78.5 7.2,78.5
  Bottom 0.406: D105.4 9.1,83.6 8.6,83.1 8.6,81.8 7.2,80.4 7.2,78.5 7.2,64.5 8.4,63.3 15.1,63.3 v16.3,62.1
WS2812_DATA_OUT  (via drill 0.4)
  Top 0.305: v85.7,63.2 85.7,60.7 v84.2,59.2 | v57.1,42.8 v57.1,48.2 | v52.5,50.5 52.2,50.8 X3.8
  Bottom 0.305: v85.7,63.2 85.7,64.1 85.6,64.2 85,64.8 81,64.8 80.7,65.1 80.7,66 82.08,67.38 82.58,67.88 D100.2 | v57.1,42.8 57.3,43 76.3,43 79.1,45.8 79.1,51.5 79.1,51.7 79.2,51.8 79.6,52.2 80.5,52.2 83.1,54.8 83.1,58.1 v84.2,59.2 | v57.1,48.2 55.8,49.3 53.3,49.3 53.1,49.5 53.1,49.6 53.1,49.9 v52.5,50.5
WS2812_POWER  (via drill 0.4, 0.5)
  Top 0.305: C6.2 80.75,83.15 v80.6,83.6 | C2.2 16.25,82.85 v16.9,83.6 | C1.2 29.2,82.55 v29.2,83.6 | C4.2 41.75,82.95 v42.3,83.5 | C5.2 54.95,83.25 v55.2,83.5 | 68.05,83.45 v68.2,83.6
  Top 0.406: 64.75,75 64.75,75.3 C13.1 | C3.2 67.95,83.35 v68.2,83.6
  Top 0.813: v43.5,58.9 43.69,58.71 X3.2 | v66.5,78.8 66.5,78.7 64.6,76.6 | 64.6,76.6 T2.3 | 64.75,75.3 64.75,75.35 64.6,75.5 64.6,76.6 | v36.8,70.2 35.1,68.5 v35.1,67.6
  Bottom 0.305: TP117.P$1 41.1,60.5 40.9,60.7 40.1,60.7 39.6,60.2 39.6,58.9 | v29.2,83.6 D104.1 | v42.3,83.5 43.48,83.5 D103.1 | v55.2,83.5 56.48,83.5 D102.1 | v68.2,83.6 D101.1 | D105.1 17.5,83.6
  Bottom 0.61: 17.5,83.6 v16.9,83.6 15.9,82.6 15.9,79.7 16.25,79.35 16.5,79.35 26.95,79.35 30.58,82.98 D104.1
  Bottom 0.813: D100.1 v80.6,83.6 79.4,82.4 79.4,79.5 79.1,79.2 68.1,79.2 | v36.8,70.2 36.7,70.3 36.7,75 33,78.7 33,84.8 | v43.5,58.9 39.6,58.9 36.6,58.9 35.7,59.8 35.7,60.8 36.4,61.5 36.4,62.8 35.1,64.1 v35.1,67.6 | D101.1 69.5,83.52 69.5,82.6 68.1,81.2 68.1,79.2 | 68.1,79.2 67.6,78.8 v66.5,78.8
  Bottom 1.016: D101.1 69.5,83.68 69.5,84.8 56.5,84.8 | 56.5,84.8 43.5,84.8 | 43.5,84.8 33,84.8 31.4,84.8 30.58,83.98 D104.1 | D102.1 56.5,83.68 56.5,84.8 | D103.1 43.5,83.68 43.5,84.8
WS2812_POWER_EN  (via drill 0.4)
  Top 0.254: 48.9,43.6 v49,43.7 48.5,43.2 48.5,38.2 48.5,31.8 46.8,30.1 44.2,30.1 U1.18
  Top 0.305: R10.1 66.8,72.7 67.3,72.2 76.6,72.2 77.9,70.9 77.9,67.5 v79.1,66.3 | v84.1,63.2 84.1,62 v82.9,60.8 | v30.4,44.3 v28.2,44.3 | v24.7,54 23.95,54 R27.1
  Bottom 0.305: v79.1,66.3 79.1,64.5 79.8,63.8 83.5,63.8 v84.1,63.2 | v30.4,44.3 31.2,43.5 46.8,43.5 47.4,42.9 48.2,42.9 v49,43.7 49.3,44 75.9,44 78.1,46.2 78.1,52.4 78.9,53.2 80,53.2 82.1,55.3 82.1,60 v82.9,60.8 | v28.2,44.3 28.2,44.7 28.4,44.9 28.4,49.8 28.1,50.1 27.9,50.1 27.5,50.4 27.5,51.2 27.9,51.6 27.9,53.4 27.6,53.7 25.2,53.7 24.9,54 v24.7,54

## Text on the board
tPlace: RX | - | + | USB | TX
bPlace: GND | GND | VUSB_IN | ESP32_TX | ESP32_RX | WS2812_DATA | SD1 | USB_DP_CON | USB_DN_CON | CD0 | CLK | CND | SD3 | SD2 | GND | GDR | RESE | WS2812_POWER | GND | 3V3_SWITCHED | ESP32_!RESET | I2C_SDA | ESP32_FLASH | I2C_SCL | +3V3 | 5V | VBAT | LCD_BUSY | LCD_!RESET | LCD_D/!S | LCD_CS | LCD_SCK | PREVGL | GND | PREVGH | LCD_MOSI | GND
tNames: Reset | Flash | Do not touch | SHA2017 | https://sha2017.org/ | CAUTION: / DO NOT LOOK INTO LEDS / WITH REMAINING EYE
bNames: Still Hacking Anyway | Brought to you by: / Anne Jan Brouwer / Bas van Sisseren / Gavan Fantom / Jeroen Domburg / Markus Bechtold / Niek Blankers / Sebastian Oort / Thomas Roos | A | B | Start | Select